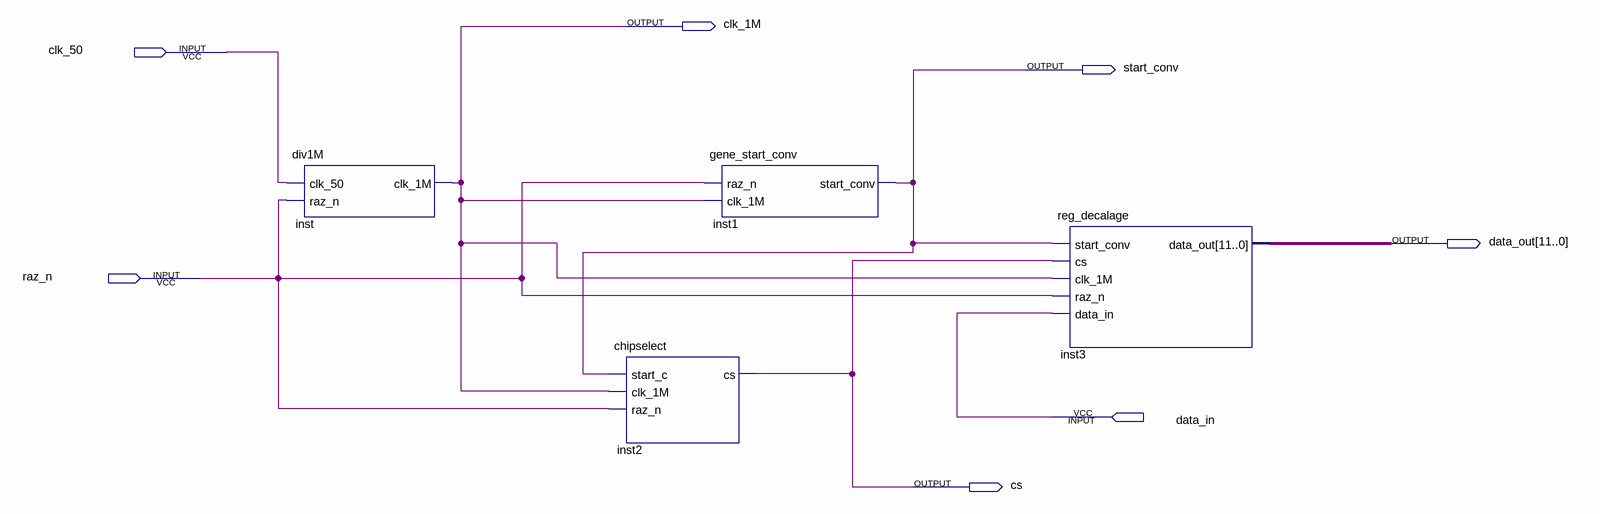
[diagram p0: schematic sheet]
// Quartus schematic bloc_conv.bdf as structural Verilog: 4 symbols, 7 pins
module bloc_conv (
  input  clk_50,
  input  raz_n,
  input  data_in,
  output clk_1M,
  output start_conv,
  output [11:0] data_out,
  output cs
);

  div1M inst (.clk_50(clk_50), .raz_n(raz_n), .clk_1M(clk_1M));
  chipselect inst2 (.start_c(start_conv), .clk_1M(clk_1M), .raz_n(raz_n), .cs(cs));
  gene_start_conv inst1 (.raz_n(raz_n), .clk_1M(clk_1M), .start_conv(start_conv));
  reg_decalage inst3 (
    .start_conv(start_conv), .cs(cs), .clk_1M(clk_1M), .raz_n(raz_n), .data_in(data_in), .data_out(data_out));
endmodule
